# EAGLE schematic MOC3032 (EAGLE 8.4.0)
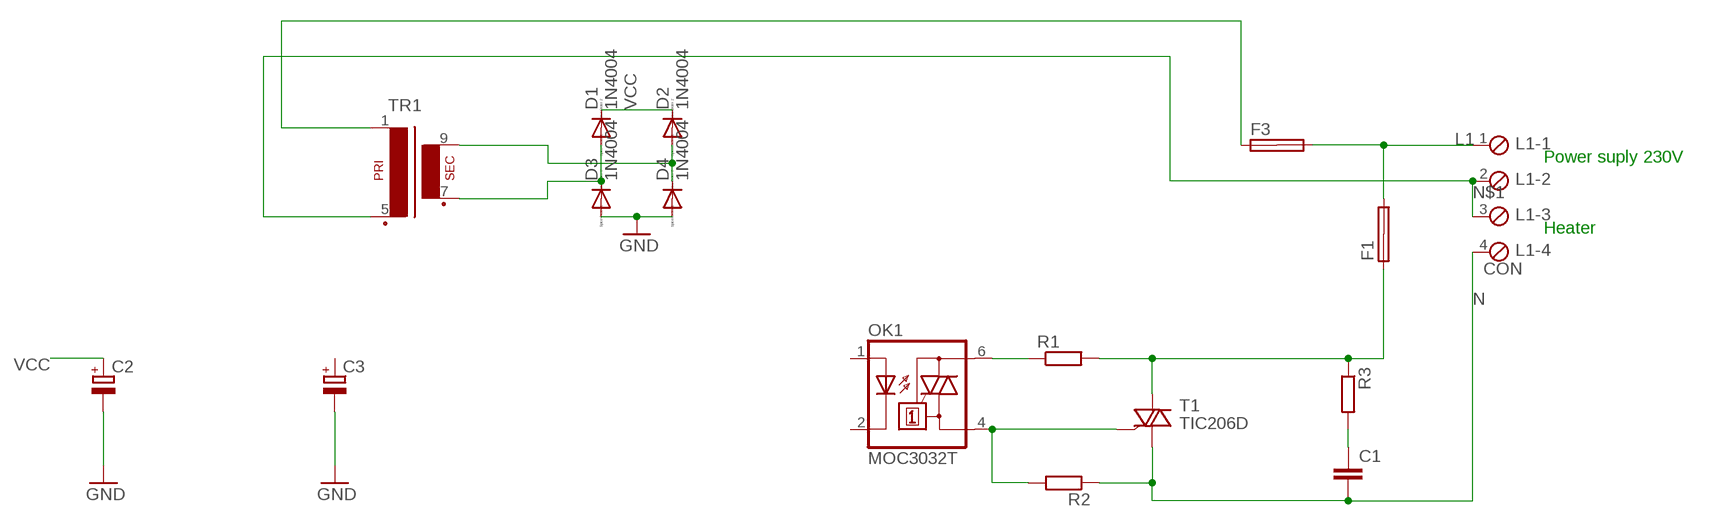
[diagram p0: schematic, sheet 1]

## Parts
C1  C-EU150-072X183  [C150-072X183]
C2  CPOL-EUE5-10.5  [E5-10,5]
C3  CPOL-EUE2.5-5  [E2,5-5]
D1  1N4004  [DO41-10]
D2  1N4004  [DO41-10]
D3  1N4004  [DO41-10]
D4  1N4004  [DO41-10]
F1  SHKOG  [SHKOG]
F3  SH32  [SH32]
L1  CON  MPT4  [4POL254]
OK1  MOC3032T  [DIL06B]
R1  R-EU_0309/12  [0309/12]
R2  R-EU_0309/12  [0309/12]
R3  R-EU_0309/12  [0309/12]
T1  TIC206D  [TO220BV]
TR1  EI30-1  [EI30-1]

## Nets
GND: C2.- D3.A D4.A
L1: F1.1A R1.2 R3.1 T1.T2(A2)
N: C1.2 L1.4 R2.1 T1.T1(A1)
N$1: L1.2 L1.3 TR1.5(P2)
N$2: OK1.4(A1) R2.2 T1.G
N$3: F1.2A F3.2A L1.1
N$4: OK1.6(A2) R1.1
N$5: C1.1 R3.2
N$6: F3.1A TR1.1
N$8: C3.- ; supply symbol labelled GND
N$9: D2.A D4.C TR1.9(S4)
N$10: D1.A D3.C TR1.7(S3)
VCC: C2.+ D1.C D2.C
Unconnected: C3.+ F1.1B F1.2B F3.1B F3.2B OK1.1(A) OK1.2(C)

## Notes on the sheet
- Power suply 230V
- Heater

## Library data of the parts
C1 = resistor:C-EU: CAPACITOR, European symbol
C2 C3 = resistor:CPOL-EU: POLARIZED CAPACITOR, European symbol
D1-D4 = diode:1N4004: DIODE general purpose rectifier, 1 A
F1 = fuse:SHKOG: FUSE HOLDER 5 x 20/6 x 32 mm, SH contact, OG 46G6083 Buerklin; OC_FARNELL: unknown; OC_NEWARK: unknown
F3 = fuse:SH32: FUSE HOLDER 6 x 32 mm, SH contact, SHH3N Schukat, 102071 Wickmann (Buerklin); MPN: 10207101009; OC_FARNELL: 811786; OC_NEWARK: 76R6904
L1 = con-phoenix-254:MPT4: PHOENIX CONNECTOR; OC_FARNELL: unknown; OC_NEWARK: unknown
OK1 = optocoupler:MOC30*: 6-Pin DIP Zero-Cross Optoisolators Triac Driver Output (250/400 Volt Peak) Source: Data sheet <http://www.fairchildsemi.com/ds/MO/MOC3031M.pdf> The old path of data sheet not more available 2013-05-06.; OC_FARNELL: unknown; OC_NEWARK: unknown
R1-R3 = resistor:R-EU_: RESISTOR, European symbol
T1 = triac:TIC206: TRIAC Source: http://www.bourns.com/pdfs/tic206.pdf
TR1 = trafo:EI30-1: TRANSFORMER 1 primary winding, 1 secondary winding ERA